# EasyEDA schematic RLC PCB.json
TITLE: Sheet_1; REV: 1.0; Date: 2024-03-03; Sheet: 1/1; Drawn By: as7764; Company: Your Company
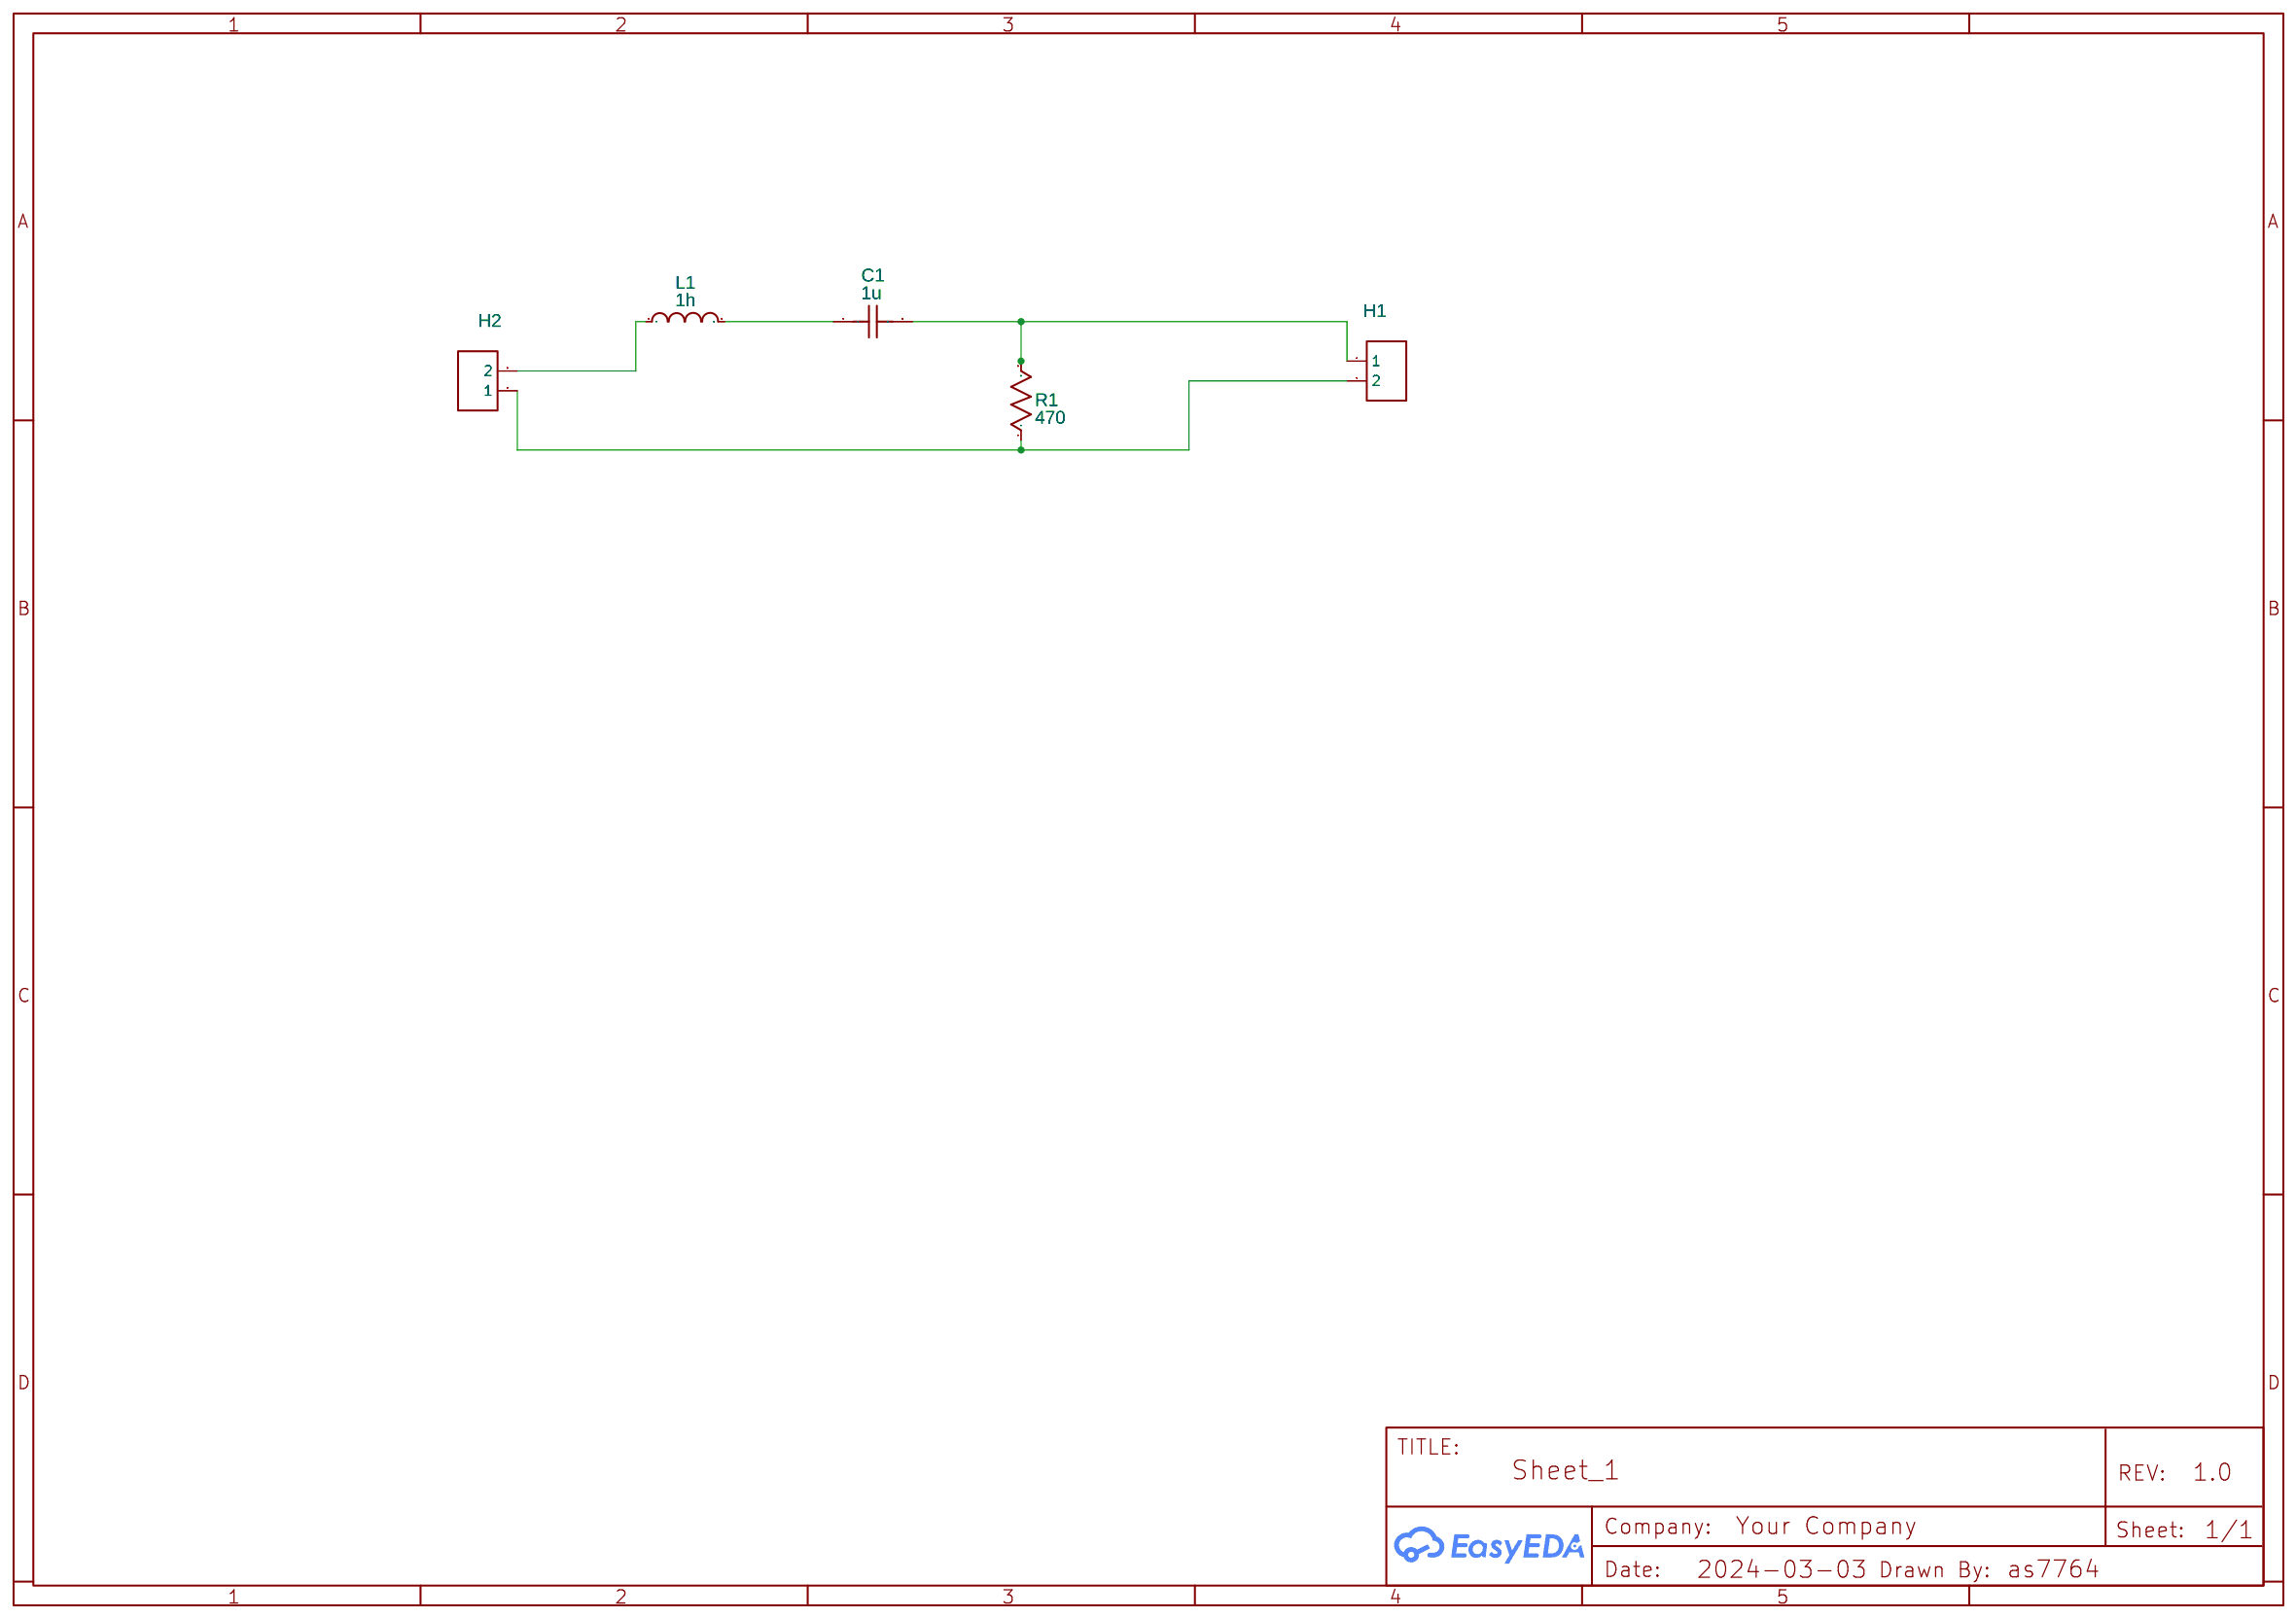
[diagram p0: schematic sheet]

## Parts
C1  1u  [RAD-0.1]
H1  HDR-F-2.54_1x2  [HDR-F-2.54_1X2]
H2  HDR-F-2.54_1x2  [HDR-F-2.54_1X2]
L1  1h  [L_AXIAL-0.4]
R1  470  [R_AXIAL-0.3]

## Library data of the parts
C1 = C_RAD-0.1_US: Contributor: LCEDA_Lib; Package Display: No
H1 H2 = HDR-F-2.54_1x2: Supplier Part: C49661; Supplier: LCSC; Contributor: LCEDA_Lib; Package Display: No
L1 = L_AXIAL-0.4_US: Contributor: LCEDA_Lib; Package Display: No
R1 = R_AXIAL-0.3_US: Contributor: LCEDA_Lib; Package Display: No

## Nets
Net-(C1-1): C1.1 L1.2
Net-(C1-2): C1.2 H1.1 R1.2
Net-(H1-2): H1.2 H2.1 R1.1
Net-(H2-2): H2.2 L1.1
